# EAGLE schematic BeagleBrasse_cape (EAGLE 6.5.0)
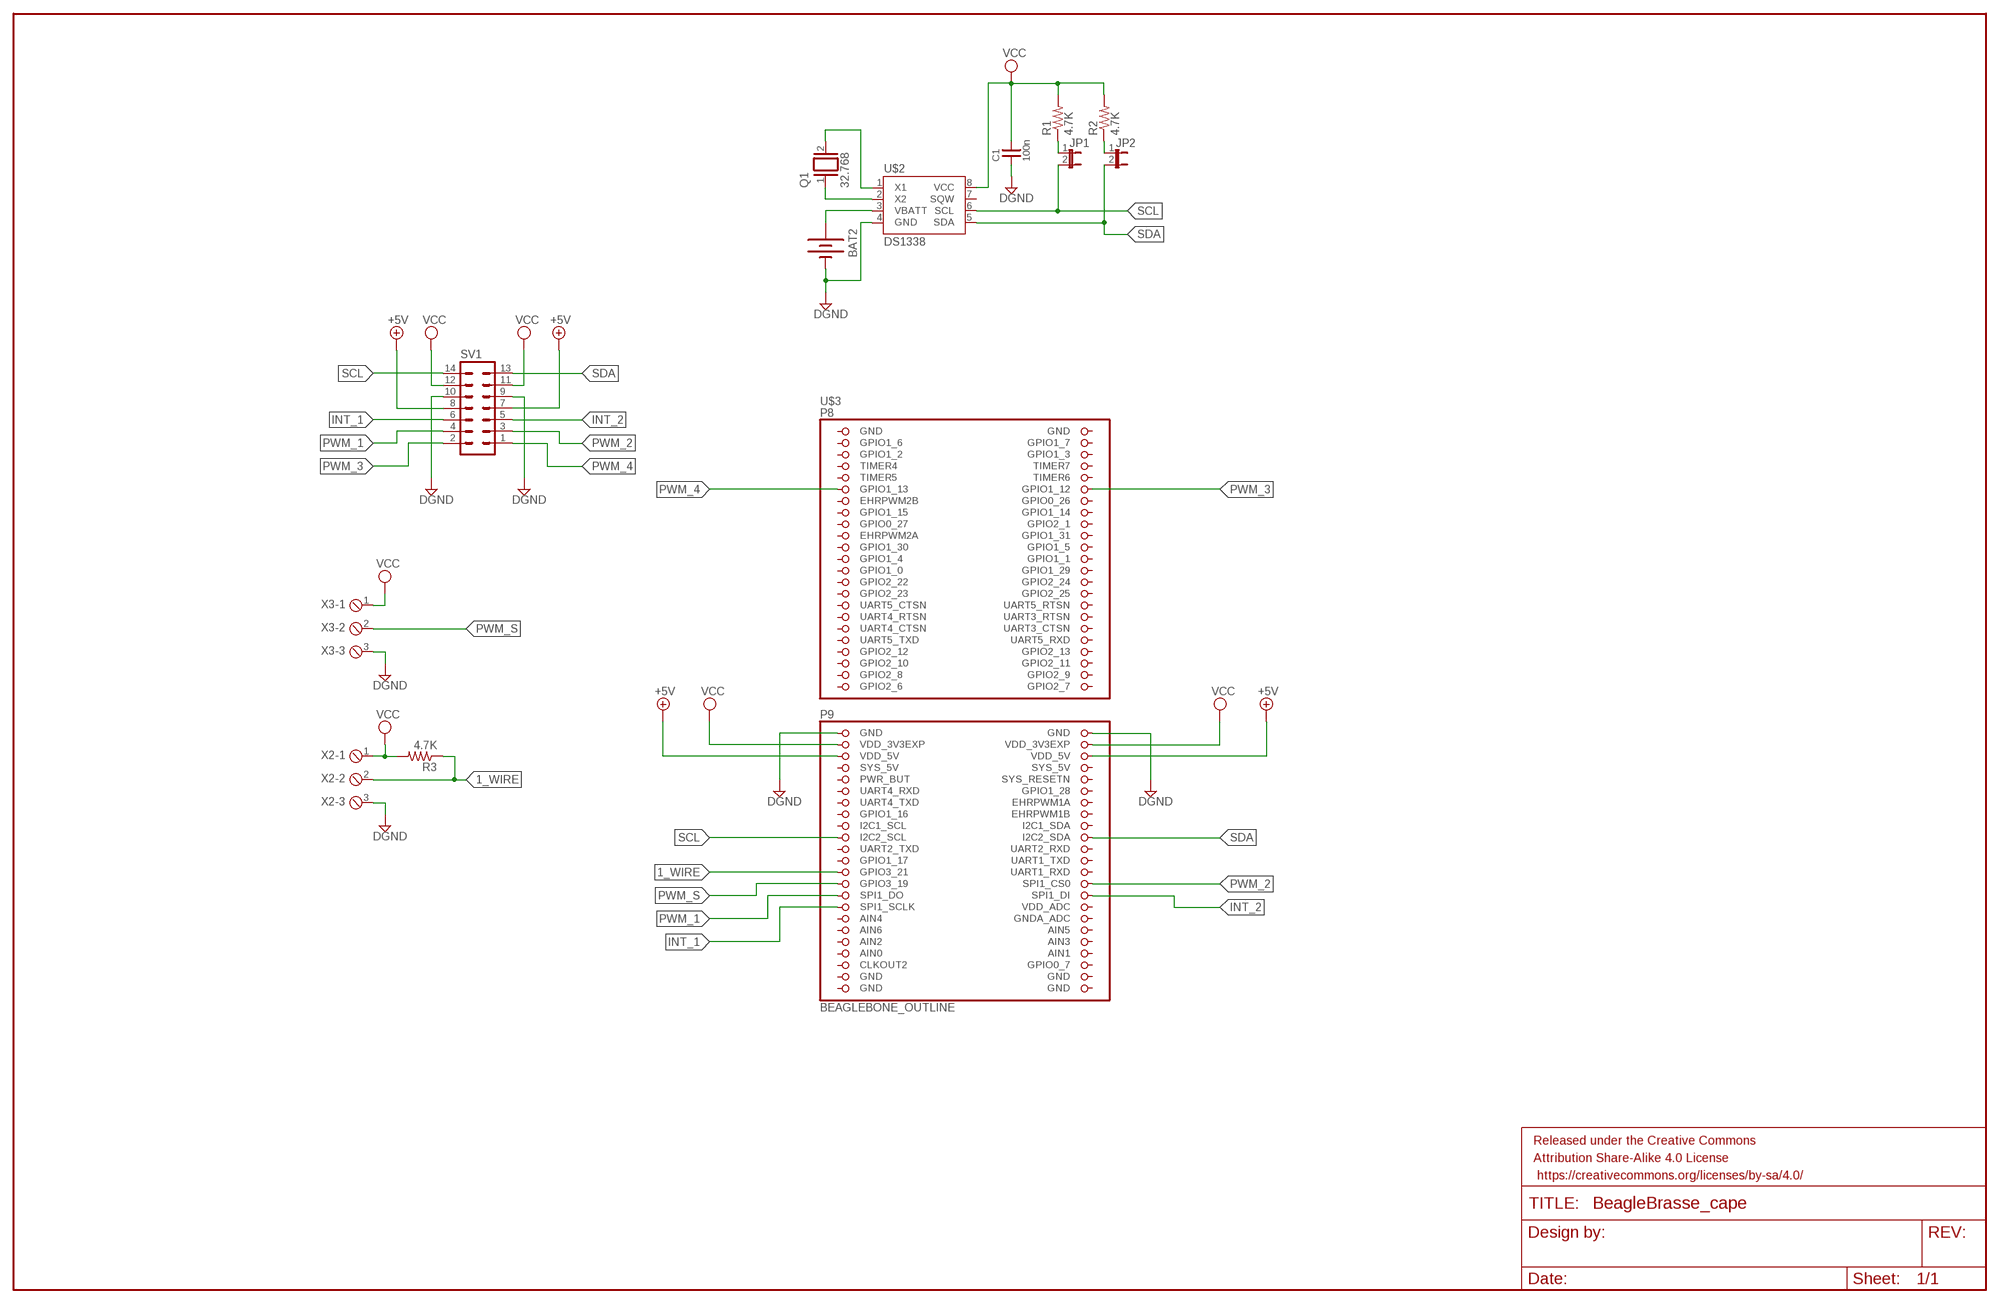
[diagram p0: schematic, sheet 1]

## Parts
BAT2  BATTERY12MM  [BATTCON_12MM]
C1  100n  C0805  [C0805]
FRAME1  FRAME-LEDGER  [CREATIVE_COMMONS]
JP1  JUMPER-2PTH  [1X02]
JP2  JUMPER-2PTH  [1X02]
Q1  32.768  XTAL  [Q]
R1  4.7K  R-US_R0805  [R0805]
R2  4.7K  R-US_R0805  [R0805]
R3  4.7K  R-US_R0805  [R0805]
SV1  ML14L  [ML14L]
U$2  DS1338  DS1307SO8  [SO08]
U$3  BEAGLEBONE_OUTLINE  [BEAGLEBONE_SHIELD]
X2  MPT3  [3POL254]
X3  MPT3  [3POL254]

## Nets
1_WIRE: R3.1 U$3.71(GPIO3_21) X2.2
+5V: SV1.7 SV1.8 U$3.51(VDD_5V) U$3.52(VDD_5V)
DGND: BAT2.GND(-) C1.1 SV1.9 SV1.10 U$2.4(GND) U$3.47(GND) U$3.48(GND) X2.3 X3.3
INT_1: SV1.6 U$3.77(SPI1_SCLK)
INT_2: SV1.5 U$3.76(SPI1_DI)
N$3: Q1.1 U$2.2(X2)
N$4: Q1.2 U$2.1(X1)
N$5: BAT2.PWR@1(+) U$2.3(VBATT)
N$6: JP1.1 R1.1
N$7: JP2.1 R2.1
PWM_1: SV1.4 U$3.75(SPI1_DO)
PWM_2: SV1.3 U$3.74(SPI1_CS0)
PWM_3: SV1.2 U$3.12(GPIO1_12)
PWM_4: SV1.1 U$3.11(GPIO1_13)
PWM_S: U$3.73(GPIO3_19) X3.2
SCL: JP1.2 SV1.14 U$2.6(SCL) U$3.65(I2C2_SCL)
SDA: JP2.2 SV1.13 U$2.5(SDA) U$3.66(I2C2_SDA)
VCC: C1.2 R1.2 R2.2 R3.2 SV1.11 SV1.12 U$2.8(VCC) U$3.49(VDD_3V3EXP) U$3.50(VDD_3V3EXP) X2.1 X3.1
Unconnected: U$2.7(SQW) U$3.3(GPIO1_6) U$3.4(GPIO1_7) U$3.5(GPIO1_2) U$3.6(GPIO1_3) U$3.7(TIMER4) U$3.8(TIMER7) U$3.9(TIMER5) U$3.10(TIMER6) U$3.13(EHRPWM2B) U$3.14(GPIO0_26) U$3.15(GPIO1_15) U$3.16(GPIO1_14) U$3.17(GPIO0_27) U$3.18(GPIO2_1) U$3.19(EHRPWM2A) U$3.20(GPIO1_31) U$3.21(GPIO1_30) U$3.22(GPIO1_5) U$3.23(GPIO1_4) U$3.24(GPIO1_1) U$3.25(GPIO1_0) U$3.26(GPIO1_29) U$3.27(GPIO2_22) U$3.28(GPIO2_24) U$3.29(GPIO2_23) U$3.30(GPIO2_25) U$3.31(UART5_CTSN) U$3.32(UART5_RTSN) U$3.33(UART4_RTSN) U$3.34(UART3_RTSN) U$3.35(UART4_CTSN) U$3.36(UART3_CTSN) U$3.37(UART5_TXD) U$3.38(UART5_RXD) U$3.39(GPIO2_12) U$3.40(GPIO2_13) U$3.41(GPIO2_10) U$3.42(GPIO2_11) U$3.43(GPIO2_8) U$3.44(GPIO2_9) U$3.45(GPIO2_6) U$3.46(GPIO2_7) U$3.54(SYS_5V) U$3.55(PWR_BUT) U$3.56(SYS_RESETN) U$3.57(UART4_RXD) U$3.58(GPIO1_28) U$3.59(UART4_TXD) U$3.60(EHRPWM1A) U$3.61(GPIO1_16) U$3.62(EHRPWM1B) U$3.63(I2C1_SCL) U$3.64(I2C1_SDA) U$3.67(UART2_TXD) U$3.68(UART2_RXD) U$3.69(GPIO1_17) U$3.70(UART1_TXD) U$3.72(UART1_RXD) U$3.78(VDD_ADC) U$3.79(AIN4) U$3.80(GNDA_ADC) U$3.81(AIN6) U$3.82(AIN5) U$3.83(AIN2) U$3.84(AIN3) U$3.86(AIN1) U$3.87(CLKOUT2) U$3.88(GPIO0_7)

## Power pins joined to a net without a drawn wire
AIN0: U$3.85(AIN0)
GND: U$3.1(GND) U$3.2(GND) U$3.89(GND) U$3.90(GND) U$3.91(GND) U$3.92(GND)
SYS_5V: U$3.53(SYS_5V)

## Library data of the parts
BAT2 = SparkFun-Electromechanical:BATTERY: Battery Holders Various common sizes : AA, AAA, 20mm coin cell and 12mm coin cell. 20MM_4LEGS, BATT-10373
C1 = divers:C: Capacitor bipolar
FRAME1 = SparkFun-Aesthetics:FRAME-LEDGER: Schematic Frame Standard 11x14 US Ledger frame
JP1 JP2 = SparkFun-Retired:JUMPER-2: Jumper Basic 0.1" spaced jumper. Use with breakaway headers.
Q1 = special:XTAL: CRYSTAL
R1-R3 = rcl:R-US_: RESISTOR, American symbol
SV1 = con-harting-ml:ML14: HARTING; OC_FARNELL: unknown; OC_NEWARK: unknown
U$2 = SparkFun-FreqCtrl:DS1307: I2C real-time clock with battery backup.
U$3 = adafruit:BEAGLEBONE_OUTLINE: Should match A3 pinout - but not completely tested
X2 X3 = con-phoenix-254:MPT3: PHOENIX CONNECTOR; OC_FARNELL: unknown; OC_NEWARK: unknown

## Net classes
0 default: width 0.254 mm, clearance 0.203 mm
1 power: width 0.508 mm, clearance 0.203 mm